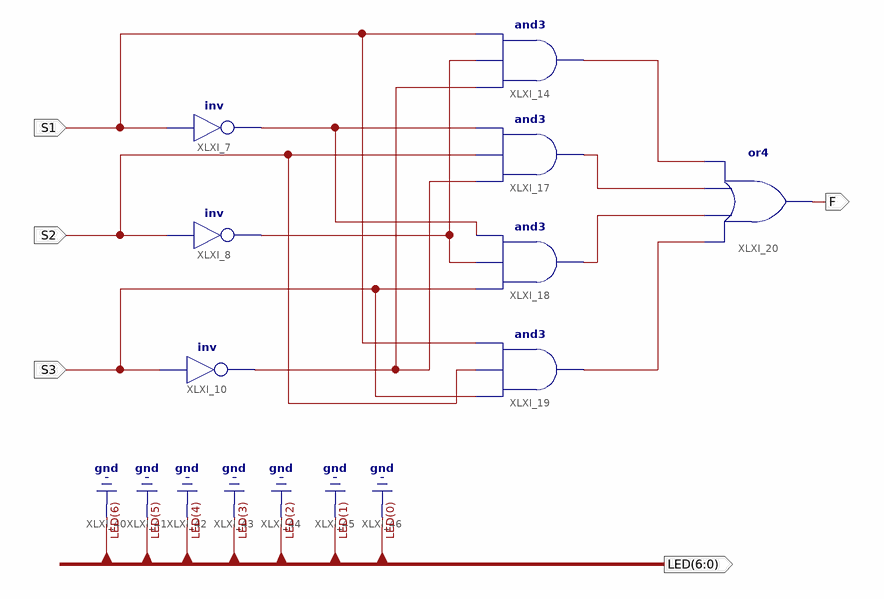
[diagram p0: schematic sheet 1]
// Xilinx ISE schematic LampCtrl.sch (kintex7) as structural Verilog: 8 symbols, 5 ports
module LampCtrl (
  input  S1,
  input  S2,
  input  S3,
  output F,
  output [6:0] LED
);

  wire XLXN_19, XLXN_22, XLXN_24, XLXN_30, XLXN_35, XLXN_36, XLXN_37;

  not XLXI_7 (XLXN_24, S1);
  not XLXI_8 (XLXN_22, S2);
  not XLXI_10 (XLXN_19, S3);
  and XLXI_14 (XLXN_30, XLXN_19, XLXN_22, S1);
  and XLXI_17 (XLXN_35, XLXN_19, S2, XLXN_24);
  and XLXI_18 (XLXN_36, S3, XLXN_22, XLXN_24);
  and XLXI_19 (XLXN_37, S3, S2, S1);
  or XLXI_20 (F, XLXN_37, XLXN_36, XLXN_35, XLXN_30);

  assign LED = {7{1'b0}};
endmodule
